# EAGLE design RN-52 Breakout (EAGLE 6.4)
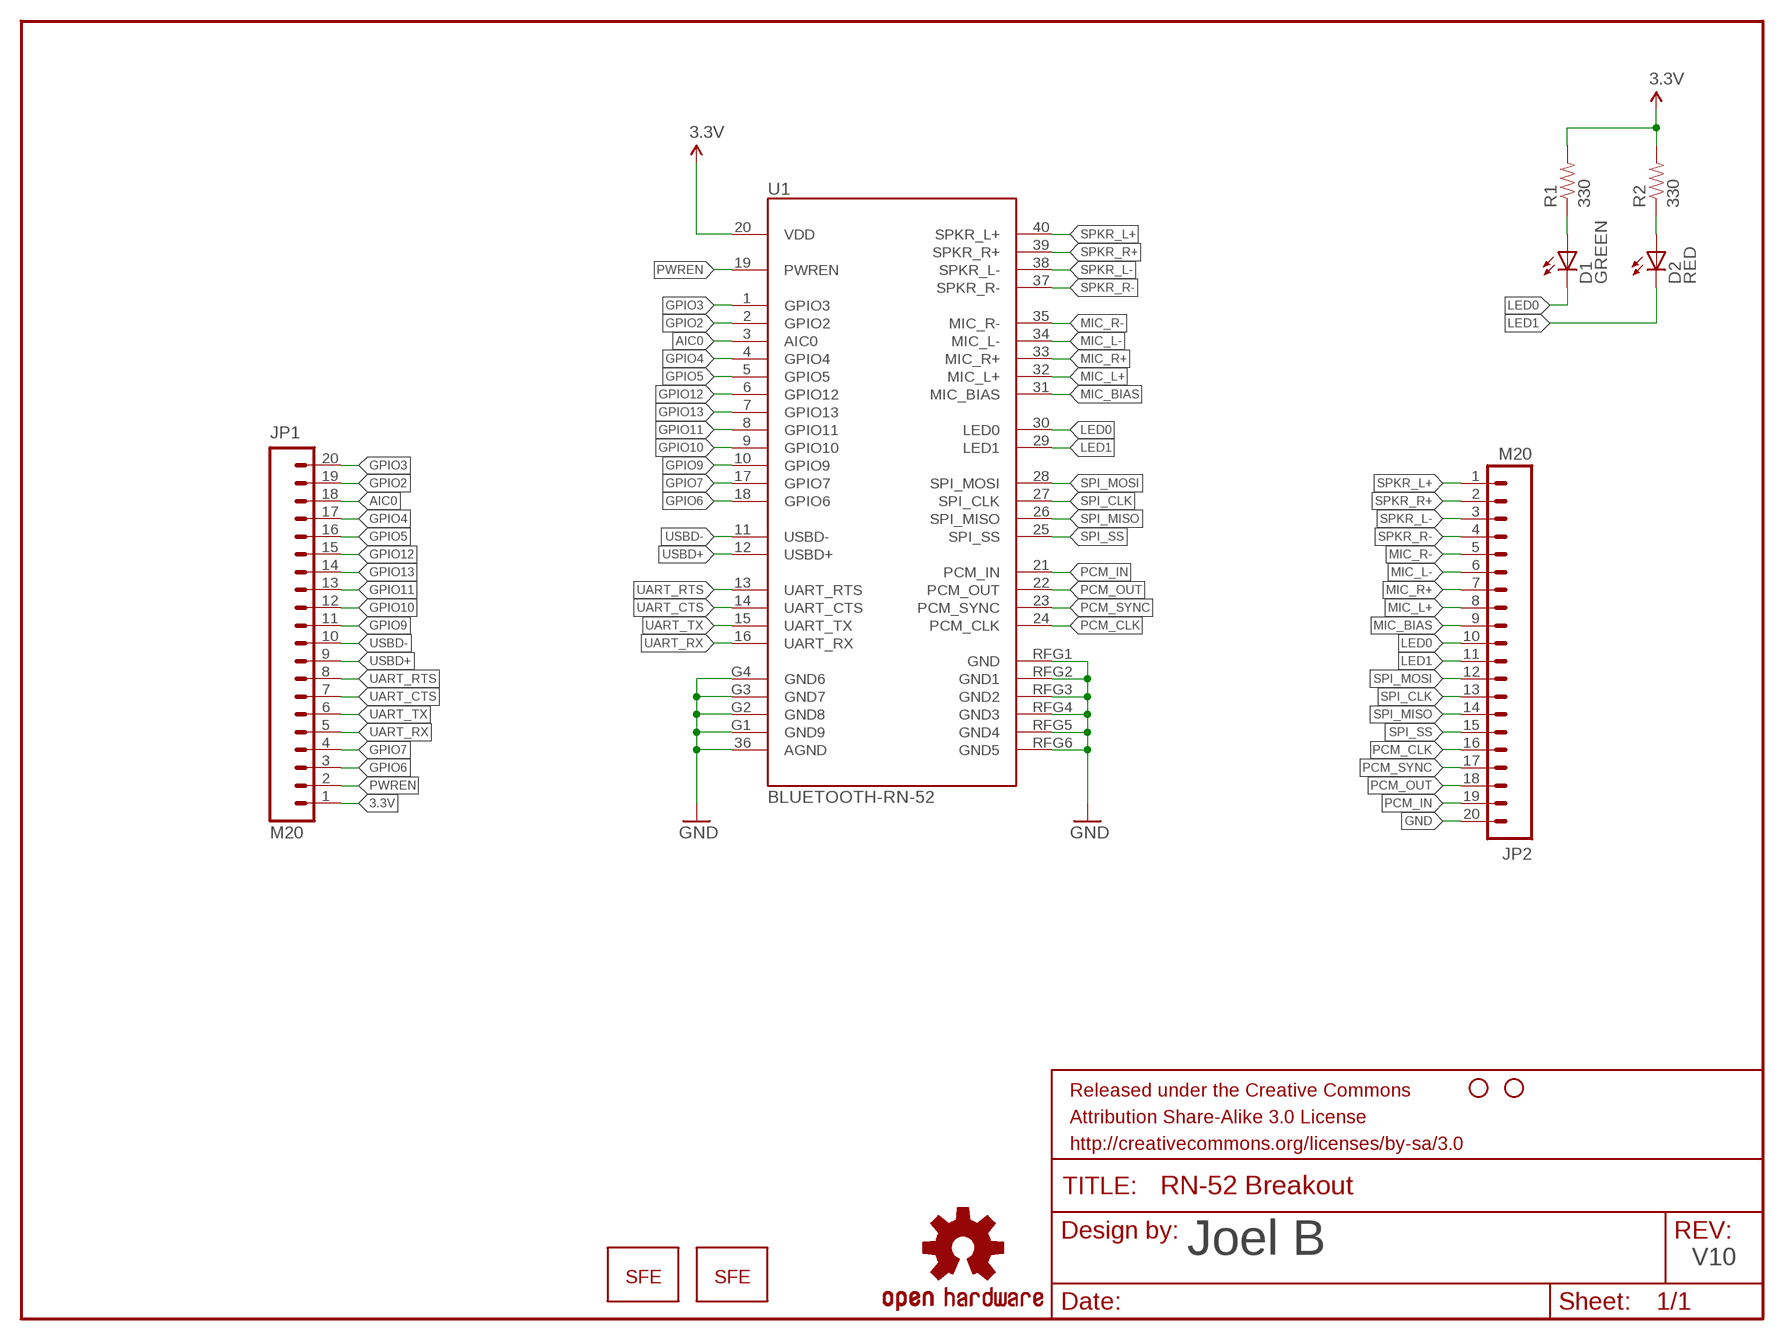
[diagram p0: schematic, sheet 1]

## Parts
D1  GREEN  LED-GREEN0603  [LED-0603]
D2  RED  LED-RED0603  [LED-0603]
FRAME1  FRAME-LETTER  [CREATIVE_COMMONS]
JP1  M20  [1X20]
JP2  M20  [1X20]
LOGO1  OSHW-LOGOS  [OSHW-LOGO-S]
LOGO3  LOGO-SFENEW  [SFE-NEW-WEBLOGO]
LOGO4  LOGO-SFENW2  [SFE-NEW-WEB]
R1  330  RESISTOR0603-RES  [0603-RES]
R2  330  RESISTOR0603-RES  [0603-RES]
STANDOFF1  STAND-OFF  [STAND-OFF]
STANDOFF2  STAND-OFF  [STAND-OFF]
U1  BLUETOOTH-RN-52  [RN-52]

## Nets
3.3V: JP1.1 R1.2 R2.2 U1.20(VDD)
AIC0: JP1.18 U1.3(AIC0)
GND: JP2.20 U1.36(AGND) U1.G1(GND9) U1.G2(GND8) U1.G3(GND7) U1.G4(GND6) U1.RFG1(GND) U1.RFG2(GND1) U1.RFG3(GND2) U1.RFG4(GND3) U1.RFG5(GND4) U1.RFG6(GND5)
GPIO2: JP1.19 U1.2(GPIO2)
GPIO3: JP1.20 U1.1(GPIO3)
GPIO4: JP1.17 U1.4(GPIO4)
GPIO5: JP1.16 U1.5(GPIO5)
GPIO6: JP1.3 U1.18(GPIO6)
GPIO7: JP1.4 U1.17(GPIO7)
GPIO9: JP1.11 U1.10(GPIO9)
GPIO10: JP1.12 U1.9(GPIO10)
GPIO11: JP1.13 U1.8(GPIO11)
GPIO12: JP1.15 U1.6(GPIO12)
GPIO13: JP1.14 U1.7(GPIO13)
LED0: D1.C JP2.10 U1.30(LED0)
LED1: D2.C JP2.11 U1.29(LED1)
MIC_BIAS: JP2.9 U1.31(MIC_BIAS)
MIC_L+: JP2.8 U1.32(MIC_L+)
MIC_L-: JP2.6 U1.34(MIC_L-)
MIC_R+: JP2.7 U1.33(MIC_R+)
MIC_R-: JP2.5 U1.35(MIC_R-)
N$1: D2.A R2.1
N$2: D1.A R1.1
PCM_CLK: JP2.16 U1.24(PCM_CLK)
PCM_IN: JP2.19 U1.21(PCM_IN)
PCM_OUT: JP2.18 U1.22(PCM_OUT)
PCM_SYNC: JP2.17 U1.23(PCM_SYNC)
PWREN: JP1.2 U1.19(PWREN)
SPI_CLK: JP2.13 U1.27(SPI_CLK)
SPI_MISO: JP2.14 U1.26(SPI_MISO)
SPI_MOSI: JP2.12 U1.28(SPI_MOSI)
SPI_SS: JP2.15 U1.25(SPI_SS)
SPKR_L+: JP2.1 U1.40(SPKR_L+)
SPKR_L-: JP2.3 U1.38(SPKR_L-)
SPKR_R+: JP2.2 U1.39(SPKR_R+)
SPKR_R-: JP2.4 U1.37(SPKR_R-)
UART_CTS: JP1.7 U1.14(UART_CTS)
UART_RTS: JP1.8 U1.13(UART_RTS)
UART_RX: JP1.5 U1.16(UART_RX)
UART_TX: JP1.6 U1.15(UART_TX)
USBD+: JP1.9 U1.12(USBD+)
USBD-: JP1.10 U1.11(USBD-)

## Notes on the sheet
- Joel B
- V10

## Library data of the parts
D1 = SparkFun-LED:LED-GREEN: Various green LEDs 0603- DIO-00821 LARGE- DIO-00862 LILYPAD- DIO-09910; PROD_ID: DIO-00821
D2 = SparkFun-LED:LED-RED: Assorted Red LEDs LilyPad 1206- DIO-09912 1206- DIO-00809 0603- DIO-00819; PROD_ID: DIO-00819
FRAME1 = SparkFun-Aesthetics:FRAME-LETTER: Schematic Frame Standard 8.5x11 US Letter frame
JP1 JP2 = SparkFun-Connectors:M20: 1x20 .1" header This is just like the LOCK variant in that the holes are staggared by 5 mil, but except for the last two holes. They are not altered from the "standard" footprint layout. This is used for a special purpose on the layout of our Graphic LCD Backpack. Make sure you want to use this device before selecting it for you project!
LOGO1 = SparkFun-Aesthetics:OSHW-LOGO: Open Source Hardware Logo This logo indicates the piece of hardware it is found on incorporates a OSHW license and/or adheres to the definition of open source hardware found here: http://freedomdefined.org/OSHW
LOGO3 LOGO4 = SparkFun-Aesthetics:LOGO-SFE: Spark Fun Electronics PCB Logo This is the standard Spark Fun Electronics PCB logo.
R1 R2 = SparkFun-Resistors:RESISTOR: Resistor Basic schematic elements and footprints for 0603, 1206, and PTH resistors.
STANDOFF1 STANDOFF2 = SparkFun-Electromechanical:STAND-OFF: #4 Stand Off This is the mechanical footprint for a #4 phillips button head screw. Use the keepout ring to avoid running the screw head into surrounding components. SKU : PRT-00447
U1 = SparkFun-RF:BLUETOOTH-RN-52

## Board
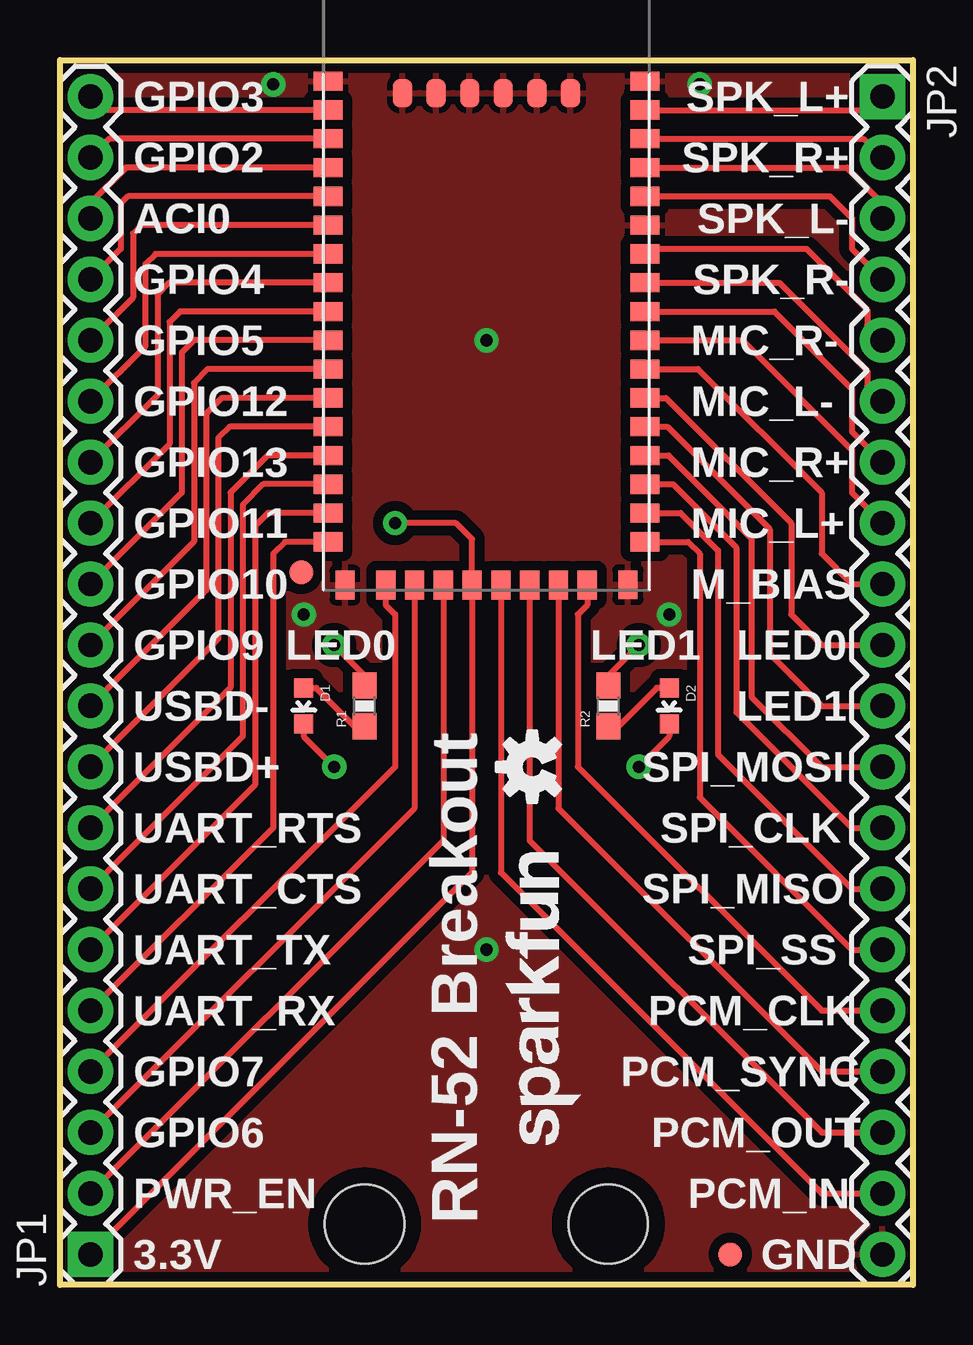
[diagram p1: board, top side]
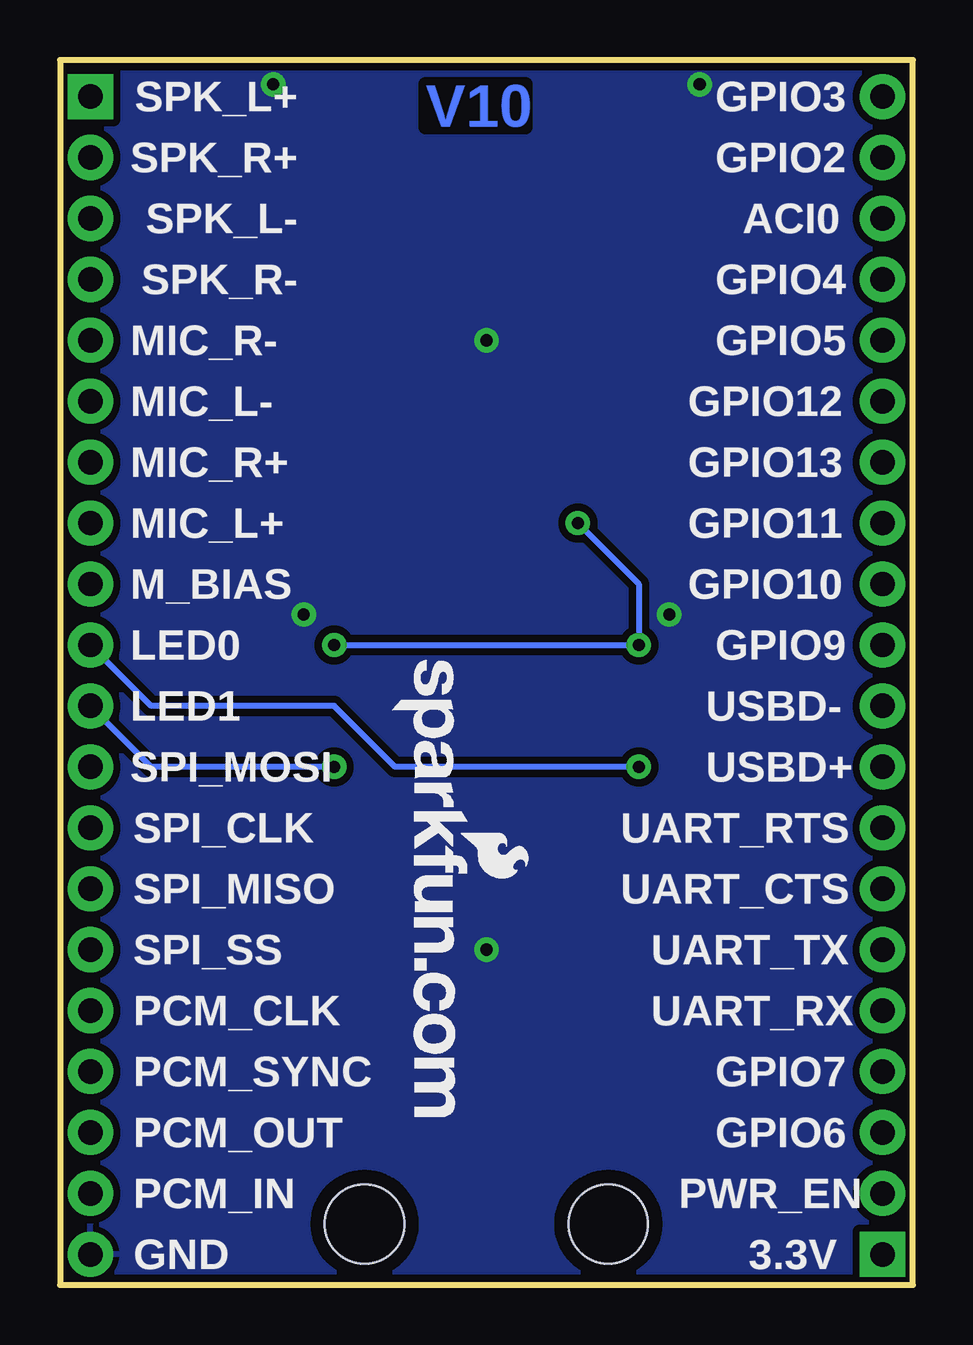
[diagram p2: board, bottom side, seen from below]

Size 35.56 x 51.05 mm. Coordinates in mm from the lower left corner, seen from the top.
Outline: 0,51.05 35.56,51.05 35.56,0 0,0 0,51.05
Copper layers (1*16): Top 0.035mm / dielectric 1.5mm / Bottom 0.035mm
Design rules "default *": minimum track width 7mil, minimum drill 15mil, track to track 8mil, track to pad 8mil, pad to pad 8mil, via to via 8mil, smd to smd 8mil, copper to edge 8mil, drill to drill 8mil, minimum pad ring 12mil, minimum via ring 10mil, stop-mask expansion 4mil, vias tented up to drill 20mil, thermal gap 10mil

### Footprints (pad centres in the part's own frame; a part is rotated, then mirrored left to right if it is on the bottom)
LED-0603 = smd 0.8 x 0.8: A 0,-0.75; C 0,0.75
FIDUCIAL-1X2 = smd 1 x 1: 1 0,0
1X20 = drill 1.016 pad 1.88 square: 1 0,0 | drill 1.016 pad 1.88: 2 2.54,0; 3 5.08,0; 4 7.62,0; 5 10.16,0; 6 12.7,0; 7 15.24,0; 8 17.78,0; 9 20.32,0; 10 22.86,0; 11 25.4,0; 12 27.94,0; 13 30.48,0; 14 33.02,0; 15 35.56,0; 16 38.1,0; 17 40.64,0; 18 43.18,0; 19 45.72,0; 20 48.26,0
0603-RES = smd 1.1 x 1: 1 -0.85,0; 2 0.85,0
STAND-OFF = hole 3.302: 0,0
RN-52 = smd 1.2 x 0.8: 1 -6.6,8.33; 2 -6.6,7.13; 3 -6.6,5.93; 4 -6.6,4.73; 5 -6.6,3.53; 6 -6.6,2.33; 7 -6.6,1.13; 8 -6.6,-0.07; 9 -6.6,-1.27; 10 -6.6,-2.47; 11 -6.6,-3.67; 12 -6.6,-4.87; 13 -6.6,-6.07; 14 -6.6,-7.27; 15 -6.6,-8.47; 16 -6.6,-9.67; 25 6.6,-9.67; 26 6.6,-8.47; 27 6.6,-7.27; 28 6.6,-6.07; 29 6.6,-4.87; 30 6.6,-3.67; 31 6.6,-2.47; 32 6.6,-1.27; 33 6.6,-0.07; 34 6.6,1.13; 35 6.6,2.33; 36 6.6,3.53; 37 6.6,4.73; 38 6.6,5.93; 39 6.6,7.13; 40 6.6,8.33; G1 -6.6,9.53; G4 6.6,9.53 | smd 0.8 x 1.2: 17 -4.2,-11.47; 18 -3,-11.47; 19 -1.8,-11.47; 20 -0.6,-11.47; 21 0.6,-11.47; 22 1.8,-11.47; 23 3,-11.47; 24 4.2,-11.47; G2 -5.9,-11.47; G3 5.9,-11.46; RFG1 -3.5,9.03; RFG2 -2.1,9.03; RFG3 -0.7,9.03; RFG4 0.7,9.03; RFG5 2.1,9.03; RFG6 3.5,9.03

### Placement (x,y rotation side)
D1  10.16,24.13 180 top
D2  25.4,24.13 180 top
FID1  FIDUCIAL1X2  [FIDUCIAL-1X2]  10.06,29.69 0 top
FID2  FIDUCIAL1X2  [FIDUCIAL-1X2]  27.94,1.27 0 top
FRAME1  15.24,-21.59 0 top  (outside the outline)
JP1  1.27,1.27 90 top
JP2  34.29,49.53 270 top
LOGO1  19.68,21.59 90 top
LOGO3  21.72,26.04 270 bottom
LOGO4  21.72,5.84 90 top
R1  12.7,24.13 90 top
R2  22.86,24.13 90 top
STANDOFF1  12.7,2.54 0 top
STANDOFF2  22.86,2.54 0 top
U1  17.78,40.64 0 top

### Tracks (layer width: path | path; a pad name or v marks a point on that pad's centre or on a via)
3.3V  (via drill 0.51)
  Top 0.254: JP1.1 17.18,17.18 U1.20 17.18,31.08 16.51,31.75 v13.97,31.75 | R2.2 22.86,25.4 v24.13,26.67 | R1.2 12.7,25.4 v11.43,26.67
  Bottom 0.254: v24.13,26.67 v11.43,26.67 11.43,29.21 v13.97,31.75
AIC0
  Top 0.254: U1.3 2.75,46.57 1.27,45.09 JP1.18
GND  (via drill 0.51)
  other vias: 17.78,39.37 17.78,13.97 10.16,27.94 25.4,27.94 26.67,50.04 8.89,50.04
  pour Bottom (isolate 0.305): 0,50.8 35.56,50.8 35.56,0 0,0
  pour Top (isolate 0.406): 0,50.8 35.56,50.8 35.56,0 0,0
GPIO2
  Top 0.254: U1.2 2.05,47.77 JP1.19
GPIO3
  Top 0.254: U1.1 1.83,48.97 JP1.20
GPIO4
  Top 0.254: U1.4 2.83,45.37 2.54,45.09 2.54,43.18 JP1.17
GPIO5
  Top 0.254: U1.5 3.4,44.17 3.05,43.81 3.05,41.15 JP1.16
GPIO6
  Top 0.254: U1.18 14.78,19.86 JP1.3
GPIO7
  Top 0.254: U1.17 13.58,28.33 13.97,27.94 13.97,21.59 JP1.4
GPIO9
  Top 0.254: U1.10 6.17,38.17 5.59,37.59 5.59,30.99 JP1.11
GPIO10
  Top 0.254: U1.9 5.59,39.37 5.08,38.86 5.08,33.02 JP1.12
GPIO11
  Top 0.254: U1.8 5.01,40.57 4.57,40.13 4.57,35.05 JP1.13
GPIO12
  Top 0.254: U1.6 3.98,42.97 3.56,42.55 3.56,39.12 JP1.15
GPIO13
  Top 0.254: U1.7 4.56,41.77 4.06,41.27 4.06,37.08 JP1.14
LED0  (via drill 0.51)
  Top 0.254: U1.30 25.26,36.97 30.48,31.75 30.48,27.94 31.75,26.67 JP2.10 | D1.C 10.16,22.86 v11.43,21.59
  Bottom 0.254: v11.43,21.59 21.59,21.59 24.13,24.13 31.75,24.13 JP2.10
LED1  (via drill 0.51)
  Top 0.254: U1.29 25.32,35.77 29.59,31.5 29.59,26.29 31.75,24.13 JP2.11 | D2.C 25.4,22.86 v24.13,21.59
  Bottom 0.254: v24.13,21.59 31.75,21.59 JP2.11
MIC_BIAS
  Top 0.254: U1.31 26.6,38.17 31.75,33.02 31.75,30.48 33.02,29.21 JP2.9
MIC_L+
  Top 0.254: U1.32 28.45,39.37 33.02,34.8 33.02,33.02 JP2.8
MIC_L-
  Top 0.254: U1.34 29.98,41.77 33.66,38.1 33.66,37.47 JP2.6
MIC_R+
  Top 0.254: U1.33 29.79,40.57 33.02,37.34 33.02,35.56 JP2.7
MIC_R-
  Top 0.254: U1.35 24.34,42.97 24.13,43.18 31.11,43.18 33.66,40.64 33.66,40.01 JP2.5
N$1
  Top 0.254: D2.A 24.88,24.88 23.28,23.28 R2.1
N$2
  Top 0.254: D1.A 10.68,24.88 12.28,23.28 R1.1
PCM_CLK
  Top 0.254: JP2.16 31.75,11.43 21.59,21.59 21.59,27.94 21.98,28.33 U1.24
PCM_IN
  Top 0.254: U1.21 18.38,17.18 31.75,3.81 JP2.19
PCM_OUT
  Top 0.254: U1.22 19.58,18.52 31.75,6.35 JP2.18
PCM_SYNC
  Top 0.254: U1.23 20.78,19.86 31.75,8.89 JP2.17
PWREN
  Top 0.254: U1.19 15.98,18.52 JP1.2
SPI_CLK
  Top 0.254: U1.27 25.56,33.37 28.19,30.73 28.19,23.88 33.02,19.05 JP2.13
SPI_MISO
  Top 0.254: U1.26 25.87,32.17 27.43,30.61 27.43,22.1 33.02,16.51 JP2.14
SPI_MOSI
  Top 0.254: U1.28 25.37,34.57 28.83,31.11 28.83,24.51 31.75,21.59 JP2.12
SPI_SS
  Top 0.254: U1.25 26.18,30.97 26.67,30.48 26.67,20.32 33.02,13.97 JP2.15
SPKR_L+
  Top 0.254: U1.40 33.73,48.97 JP2.1
SPKR_L-
  Top 0.254: U1.38 32.8,46.57 34.29,45.09 JP2.3
SPKR_R+
  Top 0.254: U1.39 33.51,47.77 JP2.2
SPKR_R-
  Top 0.254: U1.37 32.1,45.37 33.02,44.45 33.02,43.18 JP2.4
UART_CTS
  Top 0.254: U1.14 8.48,33.37 7.62,32.51 7.62,22.86 JP1.7
UART_RTS
  Top 0.254: U1.13 8.66,34.57 7.11,33.02 7.11,24.89 JP1.8
UART_RX
  Top 0.254: U1.16 9.38,30.97 8.89,30.48 8.89,19.05 JP1.5
UART_TX
  Top 0.254: U1.15 8.68,32.17 8.13,31.62 8.13,20.83 JP1.6
USBD+
  Top 0.254: U1.12 7.07,35.77 6.6,35.31 6.6,26.92 JP1.9
USBD-
  Top 0.254: U1.11 6.74,36.97 6.1,36.32 6.1,28.96 JP1.10

### Text on the board
Bottom: V10
tPlace: SPK_L+ | GPIO3 | SPK_R+ | GPIO2 | SPK_L- | ACI0 | SPK_R- | GPIO4 | GPIO5 | MIC_R- | GPIO12 | MIC_L- | GPIO13 | MIC_R+ | GPIO11 | MIC_L+ | GPIO10 | M_BIAS | GPIO9 | LED0 | LED1 | LED0 | USBD- | LED1 | USBD+ | SPI_MOSI | UART_RTS | SPI_CLK | UART_CTS | SPI_MISO | UART_TX | SPI_SS | UART_RX | PCM_CLK | GPIO7 | PCM_SYNC | GPIO6 | PCM_OUT | PWR_EN | RN-52 Breakout | PCM_IN | 3.3V | GND
bPlace: SPK_L+ | GPIO3 | SPK_R+ | GPIO2 | SPK_L- | ACI0 | SPK_R- | GPIO4 | GPIO5 | MIC_R- | GPIO12 | MIC_L- | GPIO13 | MIC_R+ | GPIO11 | MIC_L+ | GPIO10 | M_BIAS | GPIO9 | LED0 | USBD- | LED1 | USBD+ | SPI_MOSI | UART_RTS | SPI_CLK | UART_CTS | SPI_MISO | UART_TX | SPI_SS | UART_RX | PCM_CLK | GPIO7 | PCM_SYNC | GPIO6 | PCM_OUT | PWR_EN | PCM_IN | 3.3V | GND